# EAGLE design RoboKit (EAGLE 9.6.2)
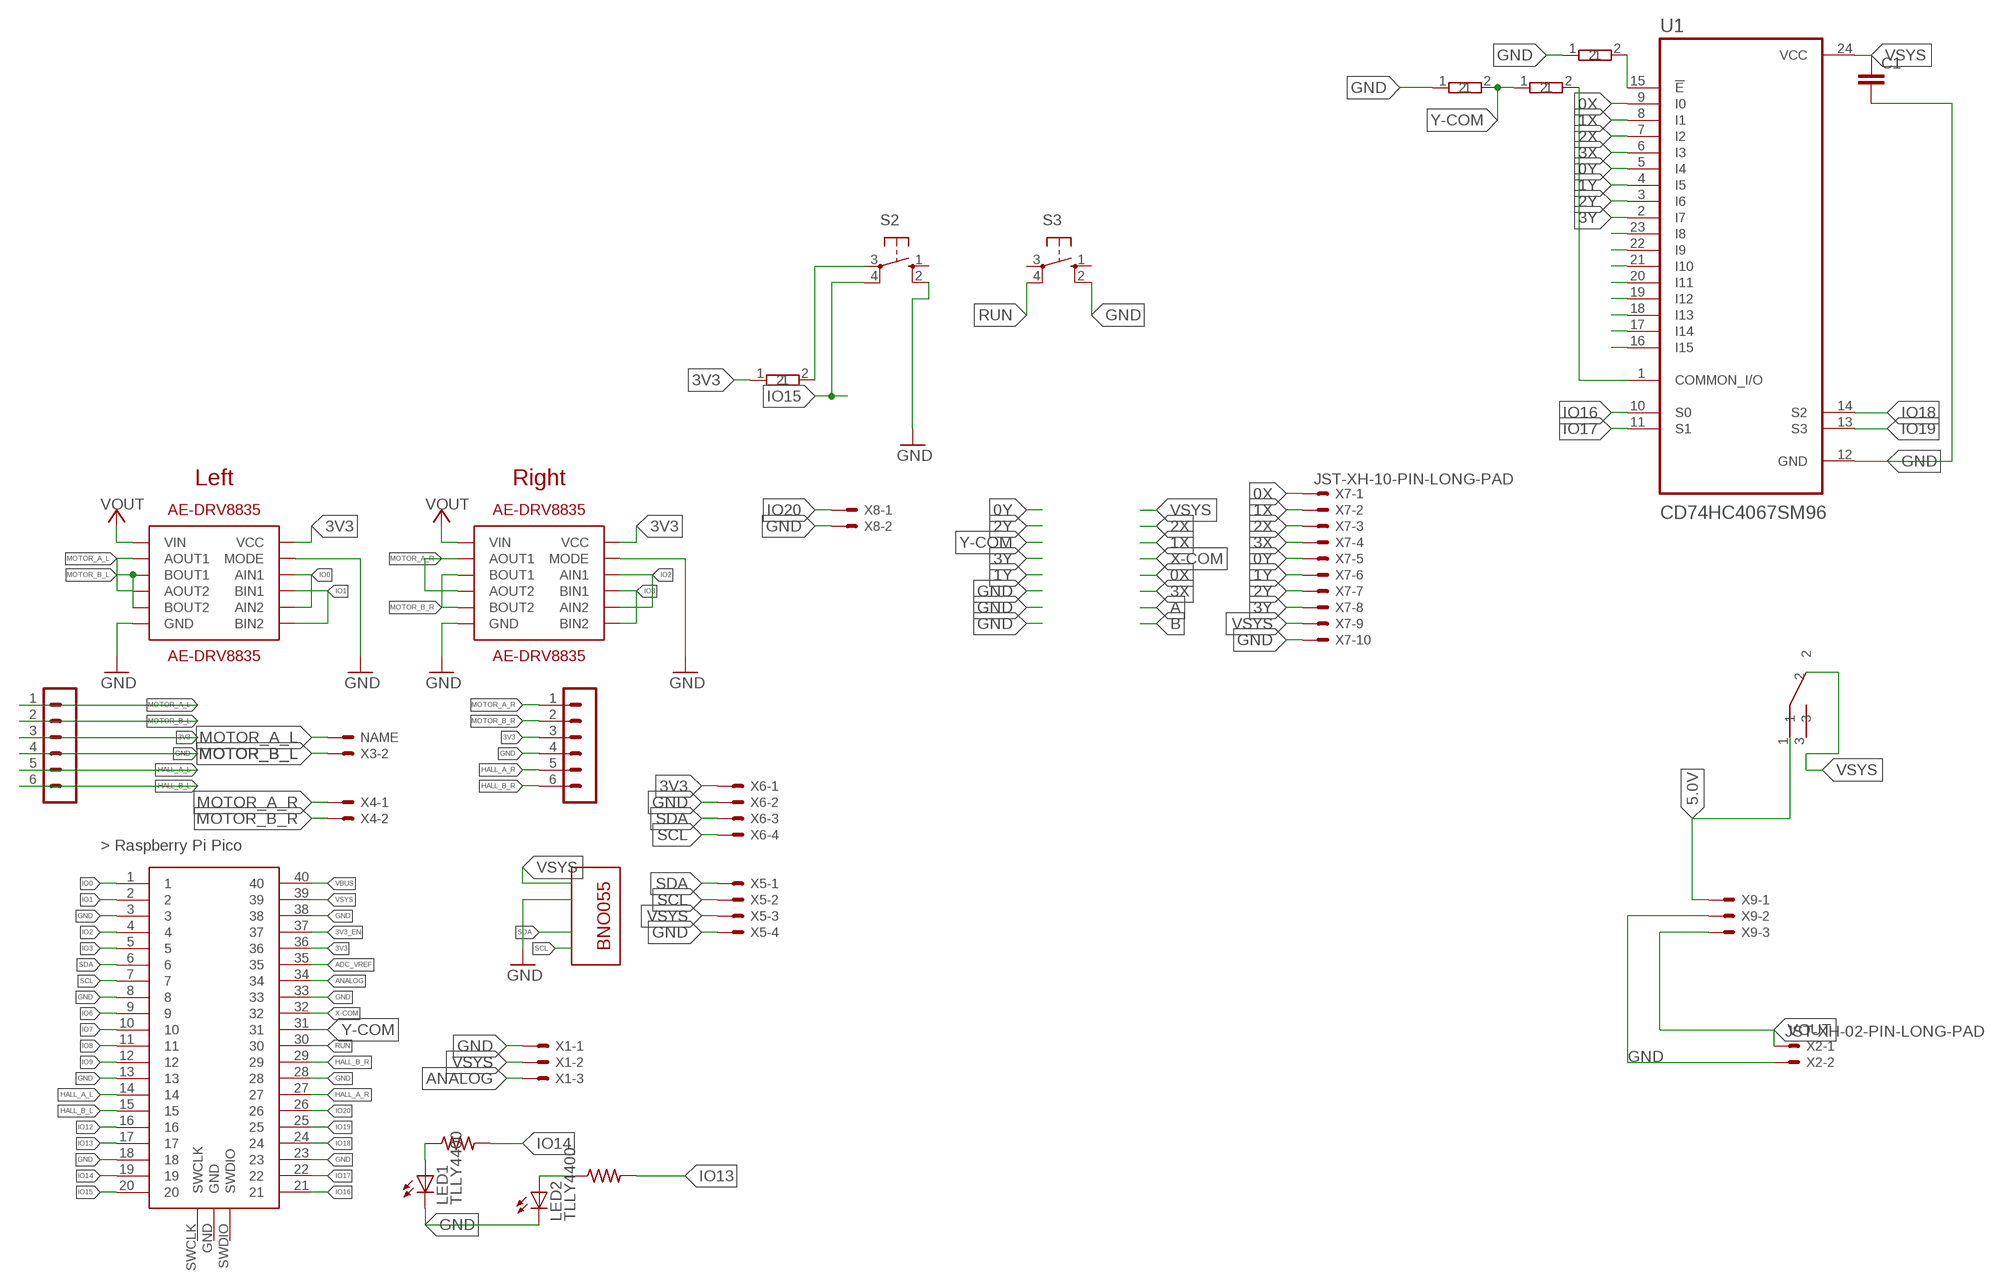
[diagram p0: schematic, sheet 1]

## Parts
C1  C-EU025-024X044  [C025-024X044]
CONNECTOR1  RESISTER  [RESISTER_SOCKET]
CONNECTOR4  RESISTER  [RESISTER_SOCKET]
CONNECTOR5  RESISTER  [RESISTER_SOCKET]
CONNECTOR6  RESISTER  [RESISTER_SOCKET]
LED1  TLLY4400  [LED3MM]
LED2  TLLY4400  [LED3MM]
P1  B6B-PH-K  [B6B-PH-K]
P2  B6B-PH-K  [B6B-PH-K]
R2  R-US_R0603  [R0603]
R3  R-US_R0603  [R0603]
S2  40-XX  [B3F-40XX]
S3  10-XX  [B3F-10XX]
U1  CD74HC4067SM96  [SOP65P780X200-24N]
U$1  RASPBERRY-PI-PICO_TH  [FT_RASPBERRY-PI-PICO_TH]
U$2  AE-DRV8835  [AE-DRV8835]
U$3  AE-DRV8835  [AE-DRV8835]
U$4  AE-BNO055-BO  [AE-BNO055-BO]
U$8  SW  [SW]
X1  JST-XH-03-PIN-LONG-PAD  [JST-XH-03-PACKAGE-LONG-PAD]
X2  JST-XH-02-PIN-LONG-PAD  [JST-XH-02-PACKAGE-LONG-PAD]
X3  JST-XH-02-PIN-LONG-PAD  [JST-XH-02-PACKAGE-LONG-PAD]
X4  JST-XH-02-PIN-LONG-PAD  [JST-XH-02-PACKAGE-LONG-PAD]
X5  JST-XH-04-PIN-LONG-PAD  [JST-XH-04-PACKAGE-LONG-PAD]
X6  JST-XH-04-PIN-LONG-PAD  [JST-XH-04-PACKAGE-LONG-PAD]
X7  JST-XH-10-PIN-LONG-PAD  [JST-XH-10-PACKAGE-LONG-PAD]
X8  JST-XH-02-PIN-LONG-PAD  [JST-XH-02-PACKAGE-LONG-PAD]
X9  JST-XH-03-PIN-LONG-PAD  [JST-XH-03-PACKAGE-LONG-PAD]

## Nets
0X: U1.9(I0) X7.1
0Y: U1.5(I4) X7.5
1X: U1.8(I1) X7.2
1Y: U1.4(I5) X7.6
2X: U1.7(I2) X7.3
2Y: U1.3(I6) X7.7
3V3 [power]: CONNECTOR1.1 P1.3 P2.3 U$1.36 U$2.VCC U$3.VCC X6.1
3V3_EN [power]: U$1.37
3X: U1.6(I3) X7.4
3Y: U1.2(I7) X7.8
5.0V [power]: U$8.1 X9.1
ADC_VREF: U$1.35
ANALOG: U$1.34 X1.3
GND: C1.2 CONNECTOR5.1 CONNECTOR6.1 LED1.K(C) LED2.K(C) P1.4 P2.4 S2.2(S1) S3.2(S1) U1.12(GND) U$1.3 U$1.8 U$1.13 U$1.18 U$1.23 U$1.28 U$1.33 U$1.38 U$2.GND U$2.MODE U$3.GND U$3.MODE U$4.GND X1.1 X2.2 X5.4 X6.2 X7.10 X8.2 X9.2
HALL_A_L: P2.5 U$1.14
HALL_A_R: P1.5 U$1.27
HALL_B_L: P2.6 U$1.15
HALL_B_R: P1.6 U$1.29
IO0: U$1.1 U$2.INA1(AIN1) U$2.INA2(AIN2)
IO1: U$1.2 U$2.INB1(BIN1) U$2.INB2(BIN2)
IO2: U$1.4 U$3.INA1(AIN1) U$3.INA2(AIN2)
IO3: U$1.5 U$3.INB1(BIN1) U$3.INB2(BIN2)
IO6: U$1.9
IO7: U$1.10
IO8: U$1.11
IO9: U$1.12
IO12: U$1.16
IO13: R3.2 U$1.17
IO14: R2.2 U$1.19
IO15: S2.4(P1) U$1.20
IO16: U1.10(S0) U$1.21
IO17: U1.11(S1) U$1.22
IO18: U1.14(S2) U$1.24
IO19: U1.13(S3) U$1.25
IO20: U$1.26 X8.1
MOTOR_A_L: P2.1 U$2.AOUT1 U$2.AOUT2 X3.1
MOTOR_A_R: P1.1 U$3.AOUT1 U$3.AOUT2 X4.1
MOTOR_B_L: P2.2 U$2.BOUT1 U$2.BOUT2 X3.2
MOTOR_B_R: P1.2 U$3.BOUT1 U$3.BOUT2 X4.2
N$1: LED1.A R2.1
N$2: CONNECTOR1.2 S2.3(P)
N$3: LED2.A R3.1
N$4: CONNECTOR6.2 U1.15(!E)
N$11: U1.23(I8)
N$12: U1.22(I9)
N$13: U1.21(I10)
N$14: U1.20(I11)
N$15: U1.19(I12)
N$16: U1.18(I13)
N$17: U1.17(I14)
N$18: U1.16(I15)
N$19: CONNECTOR4.2 U1.1(COMMON_I/O)
RUN: S3.4(P1) U$1.30
SCL: U$1.7 U$4.SCL X5.2 X6.4
SDA: U$1.6 U$4.SDA X5.1 X6.3
VBUS [power]: U$1.40
VOUT [power]: U$2.VIN U$3.VIN X2.1 X9.3
VSYS [power]: C1.1 U1.24(VCC) U$1.39 U$4.VIN U$8.2 X1.2 X5.3 X7.9
X-COM: U$1.32
Y-COM: CONNECTOR4.1 CONNECTOR5.2 U$1.31
Unconnected: S2.1(S) S3.1(S) S3.3(P) U$1.GND U$1.SWCLK U$1.SWDIO U$8.3

## Notes on the sheet
- Left | Right

## Library data of the parts
C1 = rcl:C-EU: CAPACITOR, European symbol
CONNECTOR1 CONNECTOR4-CONNECTOR6 = resistor:RESISTER: resister
LED1 LED2 = led:TLLY4400: Low Current (2mA) LED 3 mm Tinted Diffused Package color YELLOW Source: Data sheet <http://www.farnell.com/datasheets/391098.pdf>; MF: VISHAY SEMICONDUCTOR; OC_FARNELL: 1612439
P1 P2 = con-jst-ph:B6B-PH-K: HEADER
R2 R3 = rcl:R-US_: RESISTOR, American symbol
S2 = switch-omron:40-XX: OMRON SWITCH; MF: OMRON COMPONENTS USA; MPN: B3F-4000; OC_FARNELL: 176434; OC_NEWARK: 36K3105
S3 = switch-omron:10-XX: OMRON SWITCH; MPN: B3F-1000; OC_FARNELL: 176432; OC_NEWARK: 36M3542
U1 = CD74HC4067SM96:CD74HC4067SM96: Check availability <https://pricing.snapeda.com/parts/CD74HC4067SM96/Texas%20Instruments/view-part?ref=eda>; AVAILABILITY: In Stock; DESCRIPTION: 5-V, 16:1, 1-channel analog multiplexer; MF: Texas Instruments; MP: CD74HC4067SM96; PACKAGE: SSOP-24 Texas Instruments; PRICE: None; PURCHASE-URL: https://pricing.snapeda.com/search/part/CD74HC4067SM96/?ref=eda
U$1 = pipico:RASPBERRY-PI-PICO_TH: Raspberry Pi Pico microcontroller board for through-hole mounting.
U$2 U$3 = AE-DRV8835:AE-DRV8835
U$4 = AE-BNO055:AE-BNO055-BO
U$8 = akizuki sw:SW
X1 X9 = Rembrandt Electronics - JST XH Connectors v1-0:JST-XH-03-PIN: JST XH Connector 2 Pin Wire to board connector. Pitch: 2,54 mm, (0.100") Number of pins: 3 Created by Rembrandt Electronics www.rembrandtelectronics.com
X2-X4 X8 = Rembrandt Electronics - JST XH Connectors v1-0:JST-XH-02-PIN: JST XH Connector 2 Pin Wire to board connector. Pitch: 2,54 mm, (0.100") Number of pins: 2 Created by Rembrandt Electronics www.rembrandtelectronics.com
X5 X6 = Rembrandt Electronics - JST XH Connectors v1-0:JST-XH-04-PIN: JST XH Connector 2 Pin Wire to board connector. Pitch: 2,54 mm, (0.100") Number of pins: 4 Created by Rembrandt Electronics www.rembrandtelectronics.com
X7 = Rembrandt Electronics - JST XH Connectors v1-0:JST-XH-10-PIN: JST XH Connector 2 Pin Wire to board connector. Pitch: 2,54 mm, (0.100") Number of pins: 10 Created by Rembrandt Electronics www.rembrandtelectronics.com

## Net classes
0 default: width 0.48 mm
2 power: width 0.48 mm, drill 0.102 mm

## Board
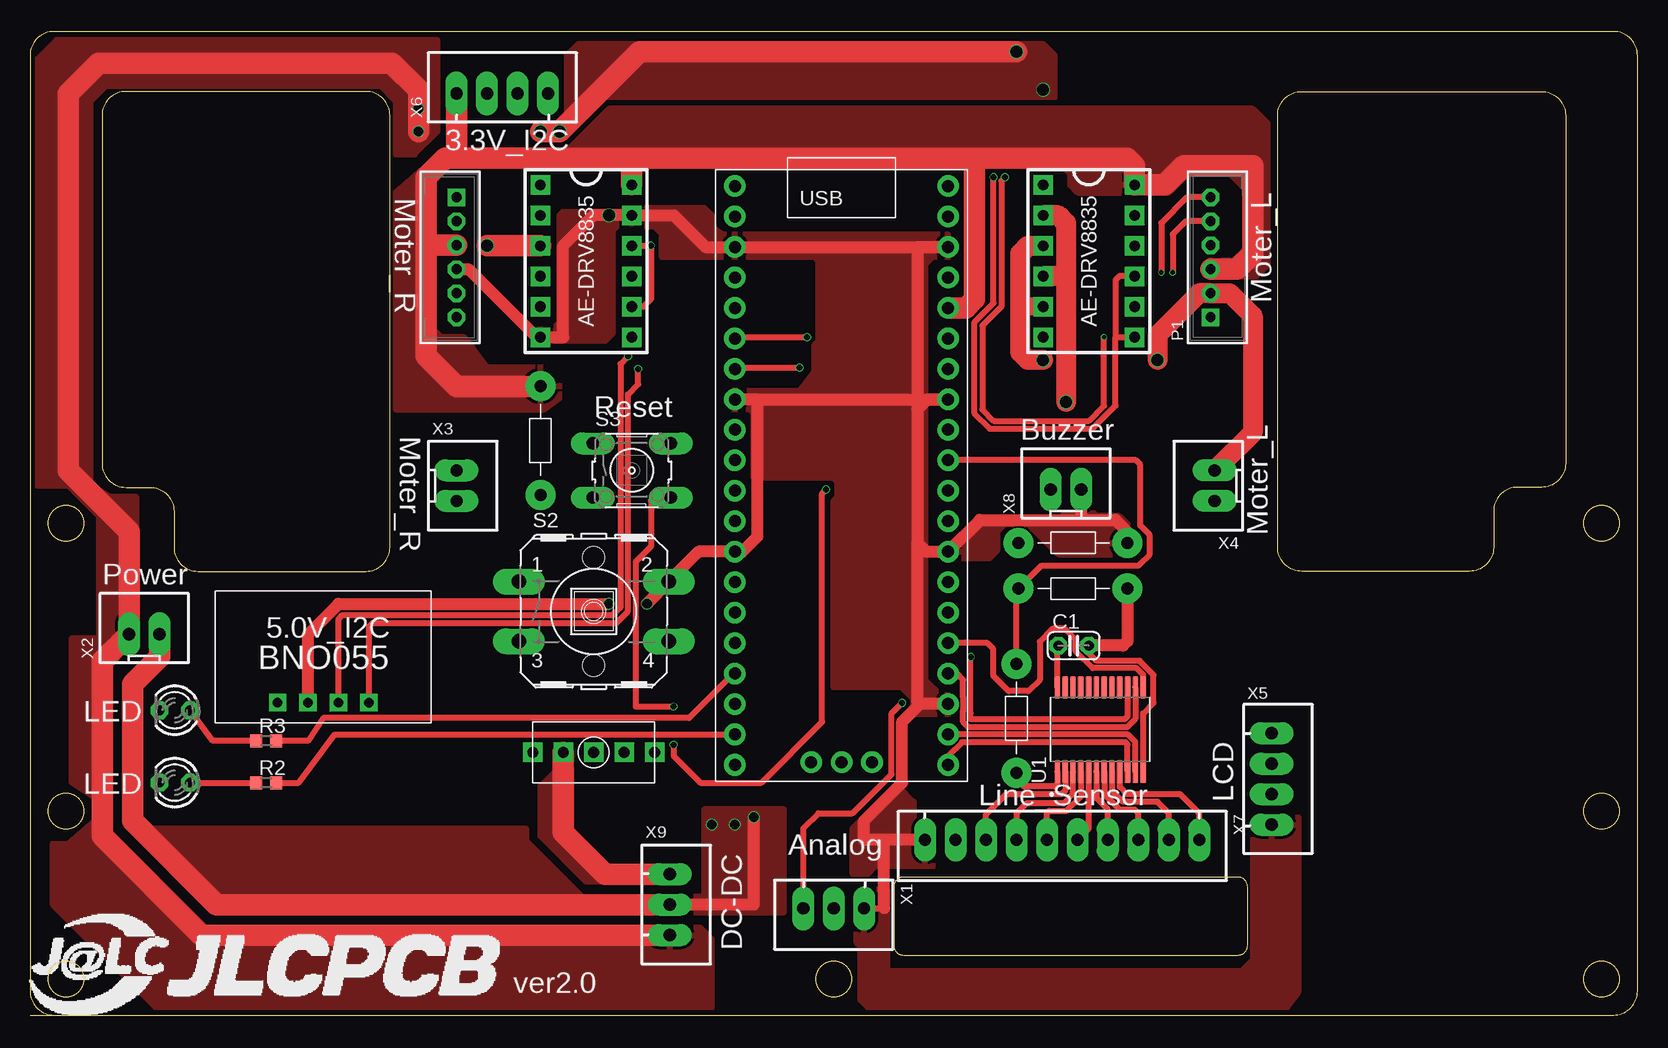
[diagram p1: board, top side]
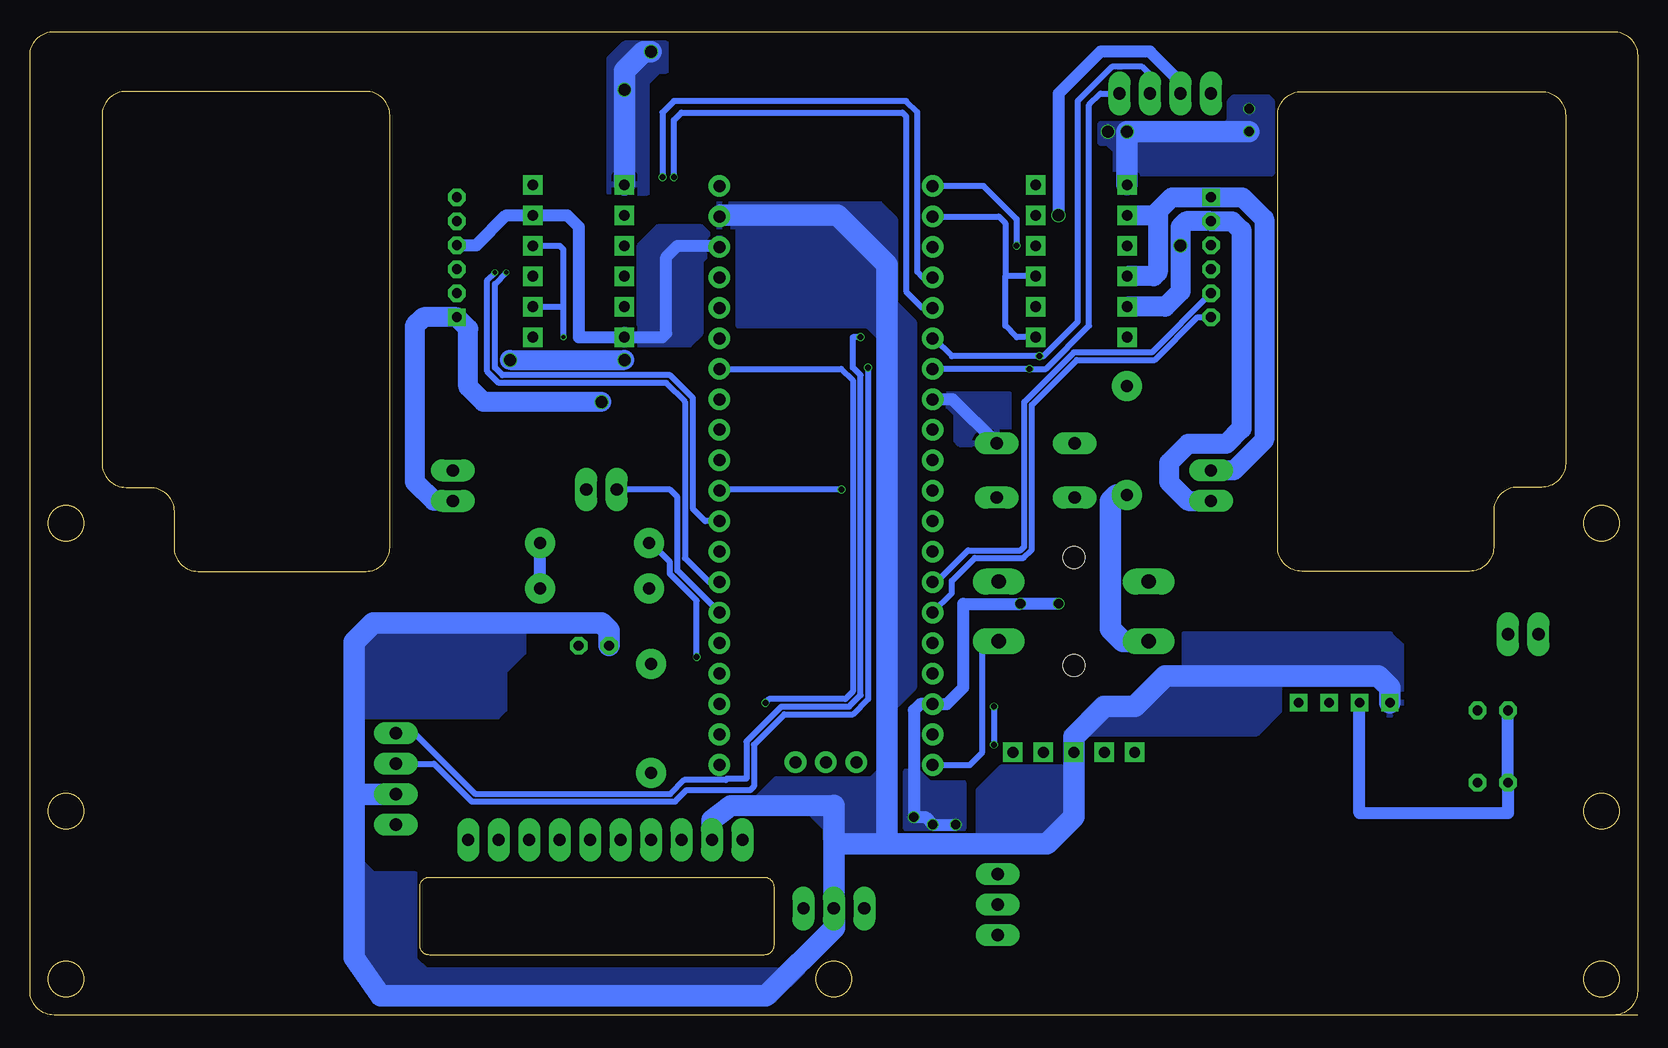
[diagram p2: board, bottom side, seen from below]

Size 134 x 82 mm. Coordinates in mm from the lower left corner, seen from the top.
Outline: 132,0 arc90 134,2
Outline: 134,80 arc90 132,82
Outline: 2,82 arc90 0,80
Outline: 0,2 arc90 2,0
Outline: 132,0 arc90 134,2
Outline: 134,80 arc90 132,82
Outline: 2,82 arc90 0,80
Outline: 0,2 arc90 2,0
Outline: 0,0 2,0
Outline: 10,44 arc-90 12,42
Outline: 12,39 arc90 14,37
Outline: 28,37 arc90 30,39
Outline: 30,75 arc90 28,77
Outline: 8,77 arc90 6,75
Outline: 6,46 arc90 8,44
Outline: 124,44 arc90 122,42
Outline: 122,39 arc-90 120,37
Outline: 106,37 arc-90 104,39
Outline: 104,75 arc-90 106,77
Outline: 126,77 arc-90 128,75
Outline: 128,46 arc-90 126,44
Outline: 132,0 arc90 134,2
Outline: 134,80 arc90 132,82
Outline: 2,82 arc90 0,80
Outline: 0,2 arc90 2,0
Outline: 10,44 arc-90 12,42
Outline: 12,39 arc90 14,37
Outline: 28,37 arc90 30,39
Outline: 30,75 arc90 28,77
Outline: 8,77 arc90 6,75
Outline: 6,46 arc90 8,44
Outline: 124,44 arc90 122,42
Outline: 122,39 arc-90 120,37
Outline: 106,37 arc-90 104,39
Outline: 104,75 arc-90 106,77
Outline: 126,77 arc-90 128,75
Outline: 128,46 arc-90 126,44
Outline: 2,0 132,0
Outline: 132,0 arc90 134,2
Outline: 134,2 134,80
Outline: 134,80 arc90 132,82
Outline: 132,82 2,82
Outline: 2,82 arc90 0,80
Outline: 0,80 0,2
Outline: 0,2 arc90 2,0
Outline: 10,44 arc-90 12,42
Outline: 12,42 12,39
Outline: 12,39 arc90 14,37
Outline: 14,37 28,37
Outline: 28,37 arc90 30,39
Outline: 30,39 30,75
Outline: 30,75 arc90 28,77
Outline: 28,77 8,77
Outline: 8,77 arc90 6,75
Outline: 6,75 6,46
Outline: 6,46 arc90 8,44
Outline: 8,44 10,44
Outline: 124,44 arc90 122,42
Outline: 122,42 122,39
Outline: 122,39 arc-90 120,37
Outline: 120,37 106,37
Outline: 106,37 arc-90 104,39
Outline: 104,39 104,75
Outline: 104,75 arc-90 106,77
Outline: 106,77 126,77
Outline: 126,77 arc-90 128,75
Outline: 128,75 128,46
Outline: 128,46 arc-90 126,44
Outline: 126,44 124,44
Outline: 100.7,11.5 72.8,11.5 arc90 72,10.7 72,5.8 arc90 72.8,5 100.7,5 arc90 101.5,5.8 101.5,10.7 arc90 100.7,11.5
Outline: circle at 3,3 radius 1.5
Outline: circle at 131,3 radius 1.5
Outline: circle at 3,17 radius 1.5
Outline: circle at 131,17 radius 1.5
Outline: circle at 3,41 radius 1.5
Outline: circle at 131,41 radius 1.5
Outline: circle at 3,3 radius 1.5
Outline: circle at 131,3 radius 1.5
Outline: circle at 3,17 radius 1.5
Outline: circle at 131,17 radius 1.5
Outline: circle at 3,41 radius 1.5
Outline: circle at 131,41 radius 1.5
Outline: circle at 67,3 radius 1.5
Outline: circle at 3,3 radius 1.5
Outline: circle at 131,3 radius 1.5
Outline: circle at 3,17 radius 1.5
Outline: circle at 131,17 radius 1.5
Outline: circle at 3,41 radius 1.5
Outline: circle at 131,41 radius 1.5
Outline: circle at 67,3 radius 1.5
Copper layers (1*16): Top 0.035mm / dielectric 1.6mm / Bottom 0.035mm
Design rules "jlcpcb-2layers": minimum track width 5mil, minimum drill 0.3mm, track to track 5mil, track to pad 5mil, pad to pad 5mil, via to via 5mil, smd to smd 5mil, copper to edge 0.2mm, drill to drill 6mil, minimum pad ring 10mil, minimum via ring 3mil, stop-mask expansion 4mil, vias tented up to drill 0mil, thermal gap 10mil

### Footprints (pad centres in the part's own frame; a part is rotated, then mirrored left to right if it is on the bottom)
C025-024X044 = drill 0.813 octagon: 1 -1.27,0; 2 1.27,0
RESISTER_SOCKET = drill 1 pad 2.5: 1 -4.5,0; 2 4.58,0
LED3MM = drill 0.813 octagon: A -1.27,0; K 1.27,0
B6B-PH-K = drill 0.813 square: 1 -5,0 | drill 0.813 octagon: 2 -3,0; 3 -1,0; 4 1,0; 5 3,0; 6 5,0
R0603 = smd 1 x 1.1: 1 -0.85,0; 2 0.85,0
B3F-40XX = drill 1.194 long: 1 -6.248,2.489; 2 6.248,2.489; 3 -6.248,-2.489; 4 6.248,-2.489 | hole 1.803: 0,-4.496; 0,4.496
B3F-10XX = drill 1.016 long: 1 -3.251,2.261; 2 3.251,2.261; 3 -3.251,-2.261; 4 3.251,-2.261
SOP65P780X200-24N = smd 1.9 x 0.48: 1 -3.505,3.575; 2 -3.505,2.925; 3 -3.505,2.275; 4 -3.505,1.625; 5 -3.505,0.975; 6 -3.505,0.325; 7 -3.505,-0.325; 8 -3.505,-0.975; 9 -3.505,-1.625; 10 -3.505,-2.275; 11 -3.505,-2.925; 12 -3.505,-3.575; 13 3.505,-3.575; 14 3.505,-2.925; 15 3.505,-2.275; 16 3.505,-1.625; 17 3.505,-0.975; 18 3.505,-0.325; 19 3.505,0.325; 20 3.505,0.975; 21 3.505,1.625; 22 3.505,2.275; 23 3.505,2.925; 24 3.505,3.575
FT_RASPBERRY-PI-PICO_TH = drill 1: 1 -8.55,24.03; 2 -8.55,21.49; 3 -8.55,18.95; 4 -8.55,16.41; 5 -8.55,13.87; 6 -8.55,11.33; 7 -8.55,8.79; 8 -8.55,6.25; 9 -8.55,3.71; 10 -8.55,1.17; 11 -8.55,-1.37; 12 -8.55,-3.91; 13 -8.55,-6.45; 14 -8.55,-8.99; 15 -8.55,-11.53; 16 -8.55,-14.07; 17 -8.55,-16.61; 18 -8.55,-19.15; 19 -8.55,-21.69; 20 -8.55,-24.23; 21 9.23,-24.23; 22 9.23,-21.69; 23 9.23,-19.15; 24 9.23,-16.61; 25 9.23,-14.07; 26 9.23,-11.53; 27 9.23,-8.99; 28 9.23,-6.45; 29 9.23,-3.91; 30 9.23,-1.37; 31 9.23,1.17; 32 9.23,3.71; 33 9.23,6.25; 34 9.23,8.79; 35 9.23,11.33; 36 9.23,13.87; 37 9.23,16.41; 38 9.23,18.95; 39 9.23,21.49; 40 9.23,24.03; GND 0.34,-24; SWCLK -2.2,-24; SWDIO 2.88,-24
AE-DRV8835 = drill 0.9 square: AOUT1 -3.81,3.81; AOUT2 -3.81,-1.27; BOUT1 -3.81,1.27; BOUT2 -3.81,-3.81; GND -3.81,-6.35; INA1 3.81,1.27; INA2 3.81,-3.81; INB1 3.81,-1.27; INB2 3.81,-6.35; MODE 3.81,3.81; VCC 3.81,6.35; VIN -3.81,6.35
AE-BNO055-BO = drill 0.8 square: GND -1.27,-3.81; SCL 3.81,-3.81; SDA 1.27,-3.81; VIN -3.81,-3.81
SW = drill 0.9 square: 1 0,2.54; 2 0,0; 3 0,-2.54; NC 0,5.08; NC2 0,-5.08
JST-XH-03-PACKAGE-LONG-PAD = drill 1.016 long: 1 -2.54,0; 2 0,0; 3 2.54,0
JST-XH-02-PACKAGE-LONG-PAD = drill 1.016 long: 1 -1.27,0; 2 1.27,0
JST-XH-04-PACKAGE-LONG-PAD = drill 1.016 long: 1 -3.81,0; 2 -1.27,0; 3 1.27,0; 4 3.81,0
JST-XH-10-PACKAGE-LONG-PAD = drill 1.016 long: 1 -11.43,0; 2 -8.89,0; 3 -6.35,0; 4 -3.81,0; 5 -1.27,0; 6 1.27,0; 7 3.81,0; 8 6.35,0; 9 8.89,0; 10 11.43,0

### Placement (x,y rotation side)
C1  87,30.8 0 top
CONNECTOR1  42.55,47.94 270 top
CONNECTOR4  82.23,24.77 270 top
CONNECTOR5  87,35.56 180 top
CONNECTOR6  87,39.37 180 top
LED1  12.06,19.37 180 top
LED2  12.06,25.4 180 top
P1  98.42,63.18 90 top
P2  35.56,63.18 270 top
R2  19.68,19.37 0 top
R3  19.68,22.86 0 top
S2  46.99,33.66 0 top
S3  50.16,45.4 0 top
U1  89.22,23.81 90 top
U$1  67.31,45.09 0 top
U$2  46.35,62.87 0 top
U$3  88.27,62.87 0 top
U$4  24.45,29.84 0 top
U$8  46.99,21.91 90 top
X1  66.99,8.89 180 top
X2  9.53,31.75 0 top
X3  35.56,44.13 270 top
X4  98.74,44.13 90 top
X5  103.5,19.68 270 top
X6  39.37,76.83 0 top
X7  86.04,14.61 180 top
X8  86.36,43.81 0 top
X9  53.34,9.21 270 top

### Tracks (layer width: path | path; a pad name or v marks a point on that pad's centre or on a via)
0X
  Top 0.48: U1.9 90.84,19.01 91.44,18.41 95.89,18.41 97.47,16.83 X7.1
0Y
  Top 0.48: X7.5 88.24,15.54 U1.5
1X
  Top 0.48: U1.8 90.19,18.71 91.12,17.78 93.98,17.78 94.93,16.83 X7.2
1Y
  Top 0.48: U1.4 87.59,18.21 86.41,17.02 84.97,17.02 84.77,16.83 X7.6
2X
  Top 0.48: U1.7 89.54,18.41 90.81,17.14 92.08,17.14 92.39,16.83 X7.3
2Y
  Top 0.48: U1.3 86.94,18.47 86.16,17.64 83.04,17.64 82.23,16.83 X7.7
3V3
  Top 1.8: P1.3 100.6,62.18 101.92,63.5 101.92,70.8 96.2,70.8 94.61,69.22 U$3.VCC 92.08,70.8 91.44,71.44 78.11,71.44 | U$1.36 78,58.95 78.74,59.69 78.74,70.8 78.11,71.44 | 50.16,71.44 U$2.VCC | P2.3 33.02,64.18 | 35.56,71.44 34.61,71.44 33.02,69.85 33.02,64.18 | 35.56,71.44 50.16,71.44 | 78.11,71.44 50.16,71.44 | X6.1 35.56,71.44 | 33.02,64.18 33.02,54.93 35.56,52.39 42.49,52.39 CONNECTOR1.1
  pour Top: 98.11,61.59 102.23,61.59 103.19,62.55 103.19,74.3 101.92,75.56 85.09,75.56 84.45,74.93 84.45,70.8 86.04,70.8 86.68,70.17 86.68,69.22 87.31,68.58 94.93,68.58 96.52,70.17 100.01,70.17 101.28,68.9 101.28,63.82 100.33,62.87 98.11,62.87
  pour Top: 85.09,75.56 48.26,75.56 44.77,72.07 44.77,70.8 85.09,70.8
  pour Top: 32.07,50.48 42.86,50.48 44.13,51.44 44.13,53.02 42.86,53.98 38.1,53.98 36.2,56.52 34.29,56.52 33.66,57.15 33.66,69.53 32.7,70.48 30.48,68.58 30.48,50.48
3X
  Top 0.48: U1.6 88.89,18.11 89.85,17.14 X7.4
3Y
  Top 0.48: U1.2 86.29,18.72 85.97,18.4 81.36,18.4 79.69,16.73 X7.8
5.0V
  Top 1.8: X9.1 47.94,11.75 44.45,15.24 U$8.1
  pour Top: 48.26,11.11 46.35,11.11 42.55,14.92 42.55,19.05 44.13,20.64 45.09,20.64 45.09,15.24 48.26,12.06
ANALOG  (via drill 0.5)
  Top 0.48: 64.45,15.56 X1.3
  Top 0.5: 64.45,15.56 65.72,16.83 68.58,16.83 71.83,20.08 71.83,25.16 v72.71,26.04
  Bottom 0.48: U$1.34 66.36,53.88
  Bottom 0.5: 66.36,53.88 65.41,52.92 65.41,26.98 66.04,26.34 72.4,26.34 v72.71,26.04
GND  (via drill 0.8, 1)
  Top 0.48: C1.2 88.27,30.16 88.9,29.53 92.48,29.53 93.66,28.35 93.66,26.04 92.79,25.16 U1.12 | X1.1 71.2,8.9
  Top 1: v60.33,16.51 60.33,9.21 X9.2 | 74.19,25.93 72.71,24.45 72.71,19.37 69.53,16.19 69.53,14.61 71.2,14.61 | U$1.23 74.19,25.93 | 87.63,41.27 79.18,41.27 U$1.28 74.71,38.63 73.98,39.37 | 87.63,41.27 X8.2 | 87.63,41.27 90.49,41.27 91.5,40.27 CONNECTOR6.1 | U$4.GND 23.18,31.75 25.72,34.29 v48.26,34.29 | P2.4 36.56,62.18 42.23,56.52 U$2.GND 44.45,56.52 44.45,64.14 46.99,66.67 v48.26,66.67 U$2.MODE 53.66,66.67 56.3,64.03 U$1.3 U$1.38 73.98,64.03 73.98,50.48 | v51.44,34.29 53.24,36.09 S2.2 55.73,38.63 U$1.13 59.4,38.63 60.64,39.88 60.64,51.34 | CONNECTOR5.1 91.5,31.17 91.12,30.8 C1.2 | 73.98,50.48 74.83,51.34 U$1.33 60.64,51.34 | 73.98,50.48 73.98,39.37 | 74.19,25.93 73.98,26.15 73.98,39.37 | 60.64,51.34 U$1.8 | 74.61,13.97 X7.10 71.2,14.61 | 71.2,8.9 71.2,14.61
  Top 1.8: X2.2 10.79,29.84 8.57,27.62 8.57,16.19 15.56,9.21 X9.2
  Bottom 1: S3.2 57.09,51.34 U$1.8 | CONNECTOR5.1 CONNECTOR6.1 | LED2.K LED1.K 10.79,16.83 23.18,16.83 U$4.GND | v48.26,34.29 v51.44,34.29 56.2,34.29 56.2,27.3 57.57,25.93 U$1.18 59.79,25.93 60.33,25.4 v60.33,16.51 59.37,16.51 v58.74,15.88 v56.83,15.88 | P1.4 96.79,64.18 94.3,66.67 U$3.MODE 89.22,66.67 88.27,65.72 88.27,56.52 U$3.GND 81.28,56.52 80.96,56.83 80.96,63.18 80.01,64.14 76.64,64.14 U$1.38 | X6.2 38.1,77.79 40.64,80.33 44.77,80.33 48.26,76.83 v48.26,66.67
  pour Top: 15.24,8.57 8.26,15.56 41.34,15.56 41.34,14.54 47.31,8.57
  pour Top: 54.29,8.57 62.87,8.57 62.87,17.14 56.2,17.14 56.2,9.84 54.29,9.84
  pour Bottom: 56.2,15.56 60.96,15.56 60.96,20.32 60.01,20.32 59.05,19.37 56.2,19.37
  pour Top: 57.15,64.14 57.15,64.77 57.47,65.09 76.52,65.09 77.15,64.45 77.15,63.82 77.15,63.5 76.83,63.18 75.25,63.18 74.61,62.55 74.61,27.94 75.88,26.67 76.52,26.67 76.83,26.35 76.83,25.4 76.52,25.08 73.66,25.08 73.66,26.35 72.71,27.3 66.99,27.3 66.99,42.86 67.31,43.18 67.31,44.45 66.99,44.77 60.33,44.77 60.33,50.16 60.01,50.48 58.42,50.48 58.1,50.8 58.1,51.75 58.42,52.07 64.14,52.07 64.45,52.39 65.41,53.66 65.41,55.88 65.72,56.2 65.72,57.47 65.72,62.87 65.41,63.18 57.47,63.18 57.15,63.5
  pour Bottom: 79.38,55.88 84.45,55.88 84.45,57.15 83.19,57.15 83.19,63.18 83.19,64.14 81.6,65.72 78.11,65.72 77.15,64.77 76.2,64.77 76.2,63.5 77.47,63.5 78.11,62.87 78.11,56.83 79.06,55.88
  pour Top: 51.12,67.31 56.2,67.31 56.83,66.67 56.83,65.72 57.78,65.09 57.78,63.18 52.7,63.18 52.7,65.09 52.07,65.72 51.12,65.72
  pour Top: 44.45,66.99 50.8,66.99 50.8,66.04 49.21,66.04 48.58,65.41 48.58,56.83 47.94,56.2 42.23,56.2 42.23,57.15 43.5,57.15 44.13,57.78 44.13,66.67
  pour Bottom: 52.39,47.62 52.39,51.75 59.05,51.75 59.05,50.8 57.47,50.8 56.83,50.16 56.83,47.94 56.52,47.62
  pour Top: 85.72,38.42 92.08,38.42 92.39,38.73 91.76,39.37 91.76,40.64 90.81,41.59 88.9,41.59 88.27,42.23 88.27,44.45 87,44.45 87,42.23 86.04,41.59 86.04,41.27 79.06,41.27 76.52,38.73 76.52,38.1 80.01,38.1 80.64,38.73 80.64,40.32 81.28,40.96 83.19,40.96
  pour Top: 68.9,10.48 71.44,10.48 71.44,3.7 101.03,3.7 101.98,4.65 101.98,16.51 105.73,16.51 105.73,1.91 104.78,0.64 69.85,0.64 69.22,1.27 69.22,5.71 68.9,6.03
  pour Top: 72.39,19.05 73.66,17.78 73.66,16.19 74.93,16.19 75.25,15.88 75.25,12.38 70.48,12.38 69.85,11.75 68.58,11.75 68.58,15.56 69.53,16.51 69.85,16.51
HALL_A_L
  Bottom 0.5: P2.5 40.5,55.24 46.99,55.24 51.12,51.12 51.12,39.05 51.44,38.73 55.8,38.73 58.44,36.09 U$1.14
HALL_A_R  (via drill 0.35)
  Top 0.5: v95.25,61.91 95.25,65.09 96.34,66.18 P1.5
  Bottom 0.5: v95.25,61.91 95.89,61.28 95.89,53.66 94.93,52.7 80.96,52.7 79.4,51.15 79.4,38.11 77.39,36.09 U$1.27
HALL_B_L
  Bottom 0.5: U$1.15 57.15,35.16 57.15,36.2 55.24,38.11 51.17,38.11 50.49,38.79 50.49,50.86 46.73,54.62 40.24,54.62 36.67,58.18 P2.6
HALL_B_R  (via drill 0.35)
  Top 0.5: v94.3,61.91 94.3,66.04 96.44,68.18 P1.6
  Bottom 0.5: v94.3,61.91 95.25,60.96 95.25,53.98 94.61,53.34 80.64,53.34 78.77,51.47 78.77,42.23 77.71,41.17 U$1.29
IO0  (via drill 0.5)
  Top 0.5: U$2.INA2 51.12,59.05 51.75,59.69 v51.75,64.14 U$2.INA1
  Bottom 0.5: v51.75,64.14 51.75,66.36 54.51,69.11 U$1.1
IO1
  Bottom 0.5: U$2.INB1 52.7,61.59 | 52.7,61.59 52.7,57.47 51.75,56.52 U$2.INB2 | U$1.2 53.24,66.58 52.7,66.04 52.7,61.59
IO2  (via drill 0.35, 0.5)
  Top 0.5: v89.53,56.52 89.53,50.8 88.27,49.53 80.33,49.53 79.38,50.48 79.38,57.47 80.96,59.05 80.96,69.53 v81.28,69.85
  Bottom 0.5: U$3.INA1 89.85,64.14 89.53,63.82 89.53,59.05 | v89.53,56.52 89.53,59.05 | U$3.INA2 89.53,59.05 | U$1.4 59.59,61.49 60.04,61.94 60.04,75.28 60.96,76.2 80.33,76.2 81.28,75.25 v81.28,69.85
IO3  (via drill 0.5)
  Top 0.5: U$3.INB1 90.81,61.59 90.49,61.28 90.49,56.52 | 90.49,56.52 U$3.INB2 | v80.33,69.85 80.33,59.37 78.74,57.78 78.74,50.16 80.01,48.9 88.58,48.9 90.49,50.8 90.49,56.52
  Bottom 0.5: v80.33,69.85 80.33,74.61 79.69,75.25 61.28,75.25 60.96,74.93 60.96,60.33 59.59,58.95 U$1.5
IO13
  Top 0.5: U$1.17 58.64,28.48 54.93,24.77 24.45,24.77 23.18,22.86 R3.2
IO14
  Top 0.5: U$1.19 33.97,23.39 33.69,23.39 25.4,23.39 22.38,19.37 R2.2
IO15
  Bottom 0.5: U$1.20 55.66,20.86 54.61,21.91 54.61,31.17 S2.4
IO16
  Top 0.48: U1.10 91.49,22.56 91.31,22.73 77.69,22.73 76.54,21.59 U$1.21
IO17
  Top 0.48: U1.11 92.14,22.79 91.54,23.39 U$1.22
IO18
  Top 0.48: U1.14 92.14,24.7 91.44,24 78.23,24 77.79,24.45 77.79,25.39 77.81,25.41 77.81,26.46 77.79,26.48 77.79,27.94 77.25,28.48 U$1.24
IO19
  Top 0.48: U1.13 92.79,28.36 92.23,28.92 88.59,28.92 87.17,30.34 87.17,31.26 86.21,32.21 85.27,32.21 84.17,31.11 84.17,27.96 83.22,27.01 81.56,27.01 80.3,28.28 80.3,30.51 79.79,31.02 U$1.25
IO20
  Bottom 0.5: U$1.26 80.03,37.05 80.03,43.18 80.64,43.81 X8.1
MOTOR_A_L
  Bottom 1.65: U$2.AOUT1 40.31,66.67 | 40.31,66.67 39.99,66.67 39.99,61.93 40.32,61.59 U$2.AOUT2 | 40.31,66.67 38.8,68.18 P2.1 32.94,68.18 31.11,66.36 31.11,47.94 33.66,45.4 X3.1
MOTOR_A_R  (via drill 1)
  Top 1.65: 86.36,61.59 U$3.AOUT2 | 86.36,61.59 86.36,66.04 85.72,66.67 U$3.AOUT1 | 86.36,61.59 v86.36,51.12
  Bottom 1.65: X4.1 100.33,42.86 101.92,44.45 101.92,57.47 101.2,58.18 P1.1 97.47,57.23 97.47,52.39 96.2,51.12 v86.36,51.12
MOTOR_B_L  (via drill 1)
  Top 1.8: v38.1,64.14 U$2.BOUT1
  Bottom 1.65: U$2.BOUT2 39.37,59.05 38.1,60.33 v38.1,64.14 38.1,65.72 37.64,66.18 P2.2 33.8,66.18 33.02,65.41 33.02,48.9 34.29,47.62 37.47,47.62 39.05,46.04 39.05,44.45 37.47,42.86 X3.2
MOTOR_B_R  (via drill 1)
  Top 1.5: U$3.BOUT2 82.55,59.05
  Top 1.65: X4.2 101.92,48.58 101.92,58.28 100.01,60.18 P1.2 97.47,60.18 93.98,56.69 v93.98,54.61 | v84.45,54.61 83.19,54.61 82.55,55.24 82.55,59.05 82.55,63.5 83.19,64.14 U$3.BOUT1
  Bottom 1.65: v93.98,54.61 v84.45,54.61
N$1
  Top 0.5: LED1.A R2.1
N$2
  Bottom 1.8: S2.3 42.91,31.17 43.95,32.2 43.95,42.86 43.45,43.36 CONNECTOR1.2
N$3
  Top 0.5: R3.1 15.24,22.86 LED2.A
N$4  (via drill 0.5)
  Top 0.48: U1.15 91.49,24.91 91.23,24.65 78.44,24.65 78.39,24.7 78.39,25.14 78.41,25.16 v78.41,29.84 v78.42,29.84
  Bottom 0.48: CONNECTOR6.2 82.23,39.37 80.65,37.79 80.65,36.79 78.42,34.56 v78.42,29.84
N$19
  Top 0.48: U1.1 85.64,19.29 85.41,19.05 82.87,19.05 82.23,19.68 CONNECTOR4.2
RUN  (via drill 0.5)
  Top 0.5: S3.4 52.03,43.14 51.75,42.86 51.75,39.05 50.48,37.78 50.48,25.72 v53.66,25.72 | v53.66,22.54 53.66,21.59 55.88,19.37 60.96,19.37 66.04,24.45 66.04,43.5 v66.36,43.81
  Bottom 0.5: v53.66,25.72 v53.66,22.54 | v66.36,43.81 76.44,43.81 U$1.30
SCL  (via drill 0.5)
  Top 0.5: U$4.SCL 28.26,32.38 28.57,32.7 48.9,32.7 49.85,33.66 49.85,51.75 50.7,52.6 v50.7,53.88 | v64.14,53.98 58.76,53.98 U$1.7
  Bottom 0.48: 73.66,19.05 73.94,18.77 79.25,18.77 80.23,17.8 97.14,17.8 97.16,17.78
  Bottom 0.5: X6.4 44.77,76.83 45.72,75.88 45.72,57.47 49.31,53.88 v50.7,53.88 U$1.7 | X5.2 100.33,20.95 97.16,17.78 | 73.66,19.05 73.66,22.54 71.12,25.08 65.41,25.08 64.14,26.35 v64.14,53.98
SDA  (via drill 0.5)
  Top 0.5: U$4.SDA 25.72,33.02 26.04,33.34 48.58,33.34 49.21,33.97 49.21,54.29 v49.85,54.93 | U$1.6 58.64,56.41 58.74,56.52 v64.77,56.52
  Bottom 0.48: 74.29,22.8 74.29,19.69 75.91,19.69 76.02,19.59 79.47,19.59 80.64,18.41 96.84,18.41 | 64.77,26.67 64.77,53.34 65.41,53.98 65.41,56.52 v64.77,56.52
  Bottom 0.5: X6.3 40.64,78.42 41.27,79.06 43.81,79.06 46.67,76.2 46.67,57.78 49.53,54.93 v49.85,54.93 57.15,54.93 58.64,56.41 U$1.6 | X5.1 101.92,23.5 96.84,18.41 | 74.29,22.8 71.37,25.72 65.72,25.72 64.77,26.67
VOUT  (via drill 0.8, 1)
  Top 1.8: v32.38,73.66 v32.38,75.56 32.38,77.15 30.16,79.38 5.71,79.38 3.17,76.83 3.17,45.4 8.26,40.32 X2.1 6.03,29.53 6.03,14.92 14.29,6.67 X9.3 | v82.23,80.33 50.8,80.33 v44.13,73.66 v42.55,73.66
  Bottom 1.8: U$2.VIN v42.55,73.66 v32.38,73.66 | v82.23,80.33 82.87,80.33 84.45,78.74 v84.45,77.15 U$3.VIN
  pour Top: 8.89,30.8 8.89,43.18 6.67,43.18 5.08,44.13 5.08,76.2 6.35,77.47 29.21,77.47 30.48,76.2 30.48,71.75 32.07,71.75 33.97,73.66 33.97,81.28 2.22,81.28 0.64,79.69 0.64,44.13 3.17,44.13 5.71,41.59 5.71,31.11 5.71,30.8
  pour Top: 8.89,31.43 6.67,29.21 6.67,15.24 14.61,7.3 55.88,7.3 56.83,6.35 56.83,0.64 10.48,0.64 1.91,9.21 1.91,14.29 3.17,14.29 5.4,16.19 5.4,18.1 3.49,19.37 3.49,31.43
  pour Top: 80.96,80.96 84.45,80.96 85.41,80.01 85.41,76.52 46.04,76.52 50.48,80.96
  pour Top: 44.77,75.25 44.77,80.01 45.72,80.96 50.8,80.96 50.8,79.38 49.53,79.38 44.77,74.3
  pour Bottom: 85.72,68.58 82.55,68.58 82.55,77.79 81.6,78.74 80.96,78.74 80.96,80.96 84.45,80.96 85.41,80.01 85.72,79.69
  pour Bottom: 30.48,76.2 30.48,70.17 42.23,70.17 42.55,69.85 43.18,69.85 43.5,70.17 43.5,72.07 44.13,72.71 44.77,72.71 44.77,74.3 34.29,74.3 33.97,74.61 33.97,76.2 33.66,76.52 30.8,76.52
VSYS
  Top 0.48: U1.24 85.64,30.71 C1.1
  Bottom 1.75: X7.9 77.15,16.27 75.56,17.46 66.99,17.46
  Bottom 1.8: U$1.39 76.44,66.67 66.67,66.67 62.55,62.55 62.55,14.29 | 62.55,14.29 49.21,14.29 46.99,16.51 U$8.2 46.99,23.18 44.45,25.72 41.91,25.72 39.37,28.26 21.59,28.26 20.64,27.3 U$4.VIN | 66.99,13.97 X1.2 66.96,8.85 66.96,7.27 72.64,1.59 104.78,1.59 107,4.76 107,18.41 | 66.99,13.97 66.67,14.29 62.55,14.29 | 66.99,17.46 66.99,13.97 | X5.3 107,18.41 | C1.1 85.72,32.07 86.36,32.7 105.41,32.7 107,31.11 107,18.41
  pour Bottom: 46.35,21.91 46.35,23.5 31.75,23.5 29.84,25.4 29.84,27.62 21.91,27.62 21.27,26.99 21.27,25.08 19.68,25.08 19.68,27.62 19.68,30.8 20.64,31.75 36.51,31.75 37.78,31.75 37.78,28.89 39.69,28.89 42.23,26.35 44.77,26.35 47.62,23.5 47.62,21.91
  pour Bottom: 46.35,20.64 53.02,20.64 54.93,18.73 54.93,14.92 54.93,13.65 49.21,13.65 46.35,16.51
  pour Bottom: 74.93,65.72 77.15,65.72 77.15,67.63 63.18,67.63 61.91,66.36 61.91,59.37 60.33,57.78 60.33,27.3 61.91,25.72 63.18,25.72 63.18,56.52 64.14,57.47 74.93,57.47
  pour Bottom: 73.34,18.1 71.75,19.68 63.82,19.68 63.18,20.32 62.87,20.32 62.87,14.61 67.63,14.61 67.63,15.56 68.9,16.83 73.34,16.83
  pour Bottom: 69.58,3.7 100.95,3.7 101.92,4.67 101.92,11.75 105.41,11.75 106.36,12.7 107.31,12.7 107.31,4.76 104.78,1.27 72.01,1.27
  pour Bottom: 92.71,33.34 92.71,30.16 94.3,28.57 94.3,25.4 94.93,24.77 104.78,24.77 107.63,24.77 107.63,31.11 105.41,33.34
Y-COM
  Top 0.5: U$1.31 92.17,46.26 92.55,45.88 92.55,40.8 93.34,40.01 93.34,38.42 92.39,37.47 84.32,37.47 CONNECTOR5.2 82.23,35.38 CONNECTOR4.1

### Text on the board
tPlace: 3.3V_I2C | Moter_R | Moter_L | Reset | Moter_R | Buzzer | Moter_L | Power | 5.0V_I2C | LED | LED | LCD | Line_Sensor | Analog | DC-DC | ver2.0